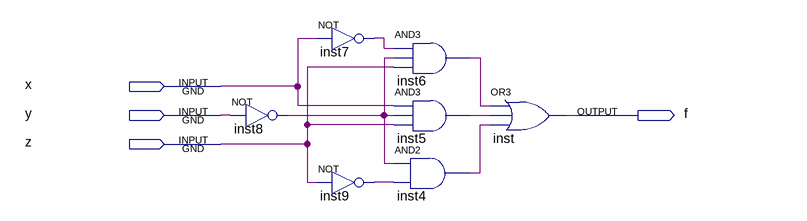
[diagram p0: schematic sheet]
// Quartus schematic 2-1-1-before.bdf as structural Verilog: 7 symbols, 4 pins
module \2-1-1-before  (
  input  x,
  input  y,
  input  z,
  output f
);

  wire inst4_out, inst5_out, inst6_out, inst7_out, inst8_out, inst9_out;

  not inst8 (inst8_out, y);
  not inst7 (inst7_out, x);
  not inst9 (inst9_out, z);
  and inst6 (inst6_out, inst7_out, inst8_out, z);
  and inst5 (inst5_out, x, inst8_out, z);
  and inst4 (inst4_out, inst8_out, inst9_out);
  or inst (f, inst6_out, inst5_out, inst4_out);
endmodule
